# Altium project IR_sensor.PrjPcb
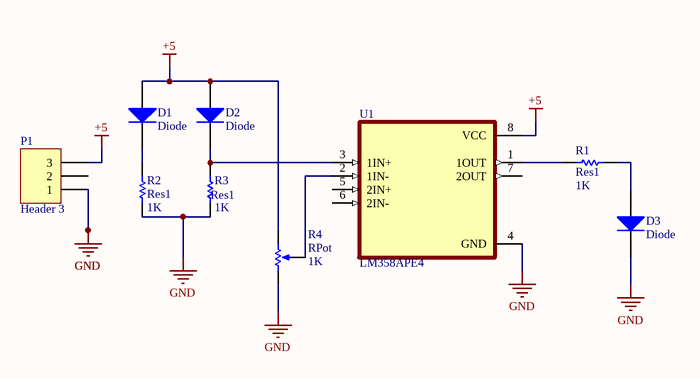
[diagram p0: Sheet1.SchDoc]
1 sheet, 9 parts. Net scope: global (net labels, ports and power ports of the same name join across sheets).
Board file: PCB1.PcbDoc

## Sheet Sheet1.SchDoc
size A; SheetNumber: 1; SheetTotal: 1; SPICEModelCacheFHMCEGMK: <root> / <DocumentId>FHMCEGMK</DocumentId> / <CacheFrame Number="0"> / <Model Name="diode" Kind="MDL"> / <Text>*Default Diode / *Diode Pinout: A,K / .MODEL DIODE D()</Text> / </Model> / </CacheFrame> / </root>

### Parts
D1  Diode  [SMC]
D2  Diode  [SMC]
D3  Diode  [SMC]
P1  Header 3  [HDR1X3]
R1  Res1  value 1K  [AXIAL-0.3]
R2  Res1  value 1K  [AXIAL-0.3]
R3  Res1  value 1K  [AXIAL-0.3]
R4  RPot  value 1K  [VR5]
U1  LM358APE4  [DIP794W45P254L959H508Q8]

### Nets
+5: D1.1(A) D2.1(A) P1.3 R4.2(BOT) U1.8(VCC)
GND: D3.2(K) P1.1 R2.2 R3.2 R4.1(TOP) U1.4(GND)
NetD1_2: D1.2(K) R2.1
NetD2_2: D2.2(K) R3.1 U1.3(1IN+)
NetD3_1: D3.1(A) R1.2
NetR1_1: R1.1 U1.1(1OUT)
NetR4_3: R4.3(TAP) U1.2(1IN-)

Not connected (* = marked no-connect by the designer): P1 2; U1 5(2IN+) 6(2IN-) 7(2OUT)

### Library data of the parts
D1-D3 = Diode: Default Diode; Published: 8-Jun-2000; LatestRevisionDate: 17-Jul-2002; LatestRevisionNote: Re-released for DXP Platform.; PackageVersion: Sep-1996; PackageReference: SMC; Publisher: Altium Limited; PackageDescription: DO-214-AB/SMC; 2 C-Bend Leads; Body 7.9 x 5.9 mm, inc. leads (LxW); Code_JEDEC: DO-214-AB
P1 = Header 3: Header, 3-Pin; LatestRevisionDate: 17-Jul-2002; LatestRevisionNote: Re-released for DXP Platform.; Publisher: Altium Limited
R1-R3 = Res1: Resistor; Published: 8-Jun-2000; LatestRevisionDate: 17-Jul-2002; LatestRevisionNote: Re-released for DXP Platform.; PackageReference: AXIAL-0.3; Publisher: Altium Limited; PackageDescription: Axial Device, Thru-Hole; 2 Leads; 0.3 in Pin Spacing
R4 = RPot: Potentiometer; Sim Note: Enter the Resistance value and the set point into parameter fields.; Set Position: 0.5; Published: 8-Jun-2000; LatestRevisionDate: 17-Jul-2002; LatestRevisionNote: Re-released for DXP Platform.; PackageReference: VR5; Publisher: Altium Limited; PackageDescription: Variable Resistor, Thru-Hole; 3 Leads
U1 = LM358APE4: Dual, 30-V, 700-kHz operational amplifier; MF: Texas Instruments; Check_prices: https://www.snapeda.com/parts/LM358APE4/Texas+Instruments/view-part/?ref=eda; Value: *; Availability: In Stock; MP: LM358APE4; Price: None; Package: PDIP-8 Texas; SnapEDA_Link: https://www.snapeda.com/parts/LM358APE4/Texas+Instruments/view-part/?ref=snap; Purchase-URL: https://pricing.snapeda.com/search/part/LM358APE4/?ref=eda